# Altium project wireless module.PrjPcb
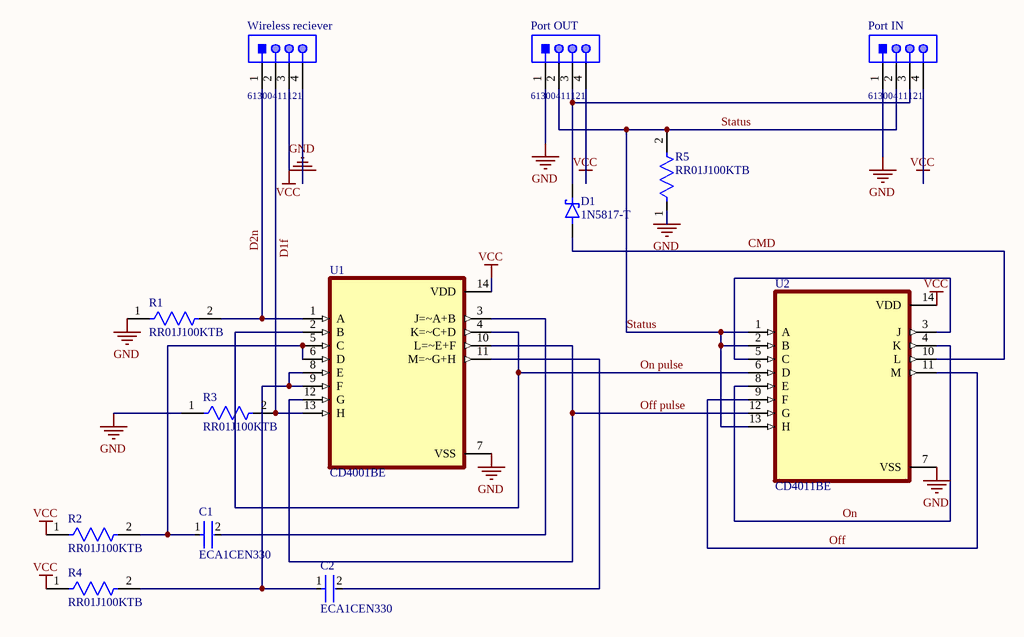
[diagram p0: Sheet1.SchDoc]
1 sheet, 13 parts. Net scope: global (net labels, ports and power ports of the same name join across sheets).
Board file: Copy of PCB1.PcbDoc

## Sheet Sheet1.SchDoc
size A; SheetNumber: 1; SheetTotal: 1

### Parts
C1  ECA1CEN330  [FP-RAD-TH-D_5_0_5-L_11_1-MFG]
C2  ECA1CEN330  [FP-RAD-TH-D_5_0_5-L_11_1-MFG]
D1  1N5817-T  [DIOAD1039W78L463D236]
Port_IN  61300411121  [61300411121]
Port_OUT  61300411121  [61300411121]
R1  RR01J100KTB  [FP-RR01-MFG]
R2  RR01J100KTB  [FP-RR01-MFG]
R3  RR01J100KTB  [FP-RR01-MFG]
R4  RR01J100KTB  [FP-RR01-MFG]
R5  RR01J100KTB  [FP-RR01-MFG]
U1  CD4001BE  [DIP794W45P254L1969H508Q14]
U2  CD4011BE  [DIP794W45P254L1969H508Q14]
Wireless_reciever  61300411121  [61300411121]

### Nets
GND: Port_IN.1 Port_OUT.1 R1.1 R3.1 R5.1 U1.7(VSS) U2.7(VSS) Wireless_reciever.4
VCC: Port_IN.4 Port_OUT.4 R2.1 R4.1 U1.14(VDD) U2.14(VDD) Wireless_reciever.3
CMD: D1.2(A) U2.10(L)
D1f: R3.2 U1.13(H) Wireless_reciever.2
D2n: R1.2 U1.1(A) Wireless_reciever.1
Off: U2.9(F) U2.11(M)
Off pulse: U1.10(L=~E+F) U1.12(G) U2.12(G)
On : U2.4(K) U2.8(E)
On pulse: U1.2(B) U1.4(K=~C+D) U2.6(D)
Status: Port_IN.2 Port_OUT.2 R5.2 U2.1(A) U2.2(B) U2.13(H)
NetC1_1: C1.1 R2.2 U1.5(C) U1.6(D)
NetC1_2: C1.2 U1.3(J=~A+B)
NetC2_1: C2.1 R4.2 U1.8(E) U1.9(F)
NetC2_2: C2.2 U1.11(M=~G+H)
NetD1_1: D1.1(K) Port_IN.3 Port_OUT.3
NetU2_3: U2.3(J) U2.5(C)

### Library data of the parts
C1 C2 = CMP-05427-001881-1: Aluminum Electrolytic Capacitors (Radial Lead Type) 33uF ±20% 16V; Ripple Current: 80mA; Lead/Base Style: Straight; Series: GA; Max Operating Temperature: 105°C; Package Quantity: 200; Lead Pitch: 2mm; Min Operating Temperature: -40°C; Mount: Through Hole; Termination: Radial; RoHS Compliant: Yes; Capacitance: 33uF; Packaging: Ammo Pack; Tolerance: 20%; Voltage Rating (DC): 16V; Case/Package: Radial
D1 = 1N5817-T: Diode Schottky 20 V 1A Through Hole DO-41; MF: Diodes Inc.; Package: DO-41 Diodes Inc.; Price: None; Check_prices: https://www.snapeda.com/parts/1N5817-T/Diodes+Inc./view-part/?ref=eda; Value: *; SnapEDA_Link: https://www.snapeda.com/parts/1N5817-T/Diodes+Inc./view-part/?ref=snap; MP: 1N5817-T; Availability: In Stock; Purchase-URL: https://pricing.snapeda.com/search/part/1N5817-T/?ref=eda
Port_IN Port_OUT Wireless_reciever = CMP-1502-01064-1: THT Vertical Pin Header WR-PHD, Pitch 2.54 mm, Single Row, 4 pins; Manufacturer: Wurth Elektronik; Withstanding Voltage: 500VAC; Rated Current: 3A; Working Voltage: 250VAC; Pin Number: 4; Gender: Male; Contact Resistance: 20mOhm; Pitch: 2.54mm; Manufacturer URL: http://www.we-online.de; Operating Temperature: -40to105degC; Packaging: Bag; Mounting Technology: THT; Package Reference: 61300411121; Datasheet URL: https://katalog.we-online.de/em/datasheet/6130xx11121.pdf; Publisher: WurthElektronik; Part Number: 61300411121; Row Number: Single; Orientation: Vertical
R1-R5 = CMP-03212-000008-1: RES 100K OHM 5% 1W AXIAL; Number of Resistors: 1; Temperature Coefficient: 300ppm/°C; Voltage Rating: 350V; Resistance: 100kR; Package Quantity: 5000; Power Rating: 1W; Packaging: Ammo Pack; Min Operating Temperature: -55°C; Number of Terminations: 2; Resistor Type: Power resistor; Length: 6.8mm; ELV: Compliant; Mount: Axial; RoHS Compliant: Yes; Case/Package: Metal; Diameter: 2.6mm; Termination: Axial; Series: RR; Max Operating Temperature: 155°C; Tolerance: 5%
U1 = CD4001BE: CMOS Quad 2-Input NOR Gate 14-PDIP -55 to 125; MF: Texas Instruments; Value: *; Texas_Instruments-Purchase-URL: https://snapeda.com/shop?store=Texas+Instruments&id=2748659; Availability: Unavailable; Price: None; MP: CD4001BE; Package: PDIP-14 Texas Instruments; DigiKey-Purchase-URL: https://snapeda.com/shop?store=DigiKey&id=2748659; SnapEDA_Link: https://www.snapeda.com/parts/CD4001BE/Texas%20Instruments/view-part/2748659/?ref=snap; Mouser-Purchase-URL: https://snapeda.com/shop?store=Mouser&id=2748659
U2 = CD4011BE: Package: None; MP: CD4011BE; Value: *; Availability: Unavailable; Price: None